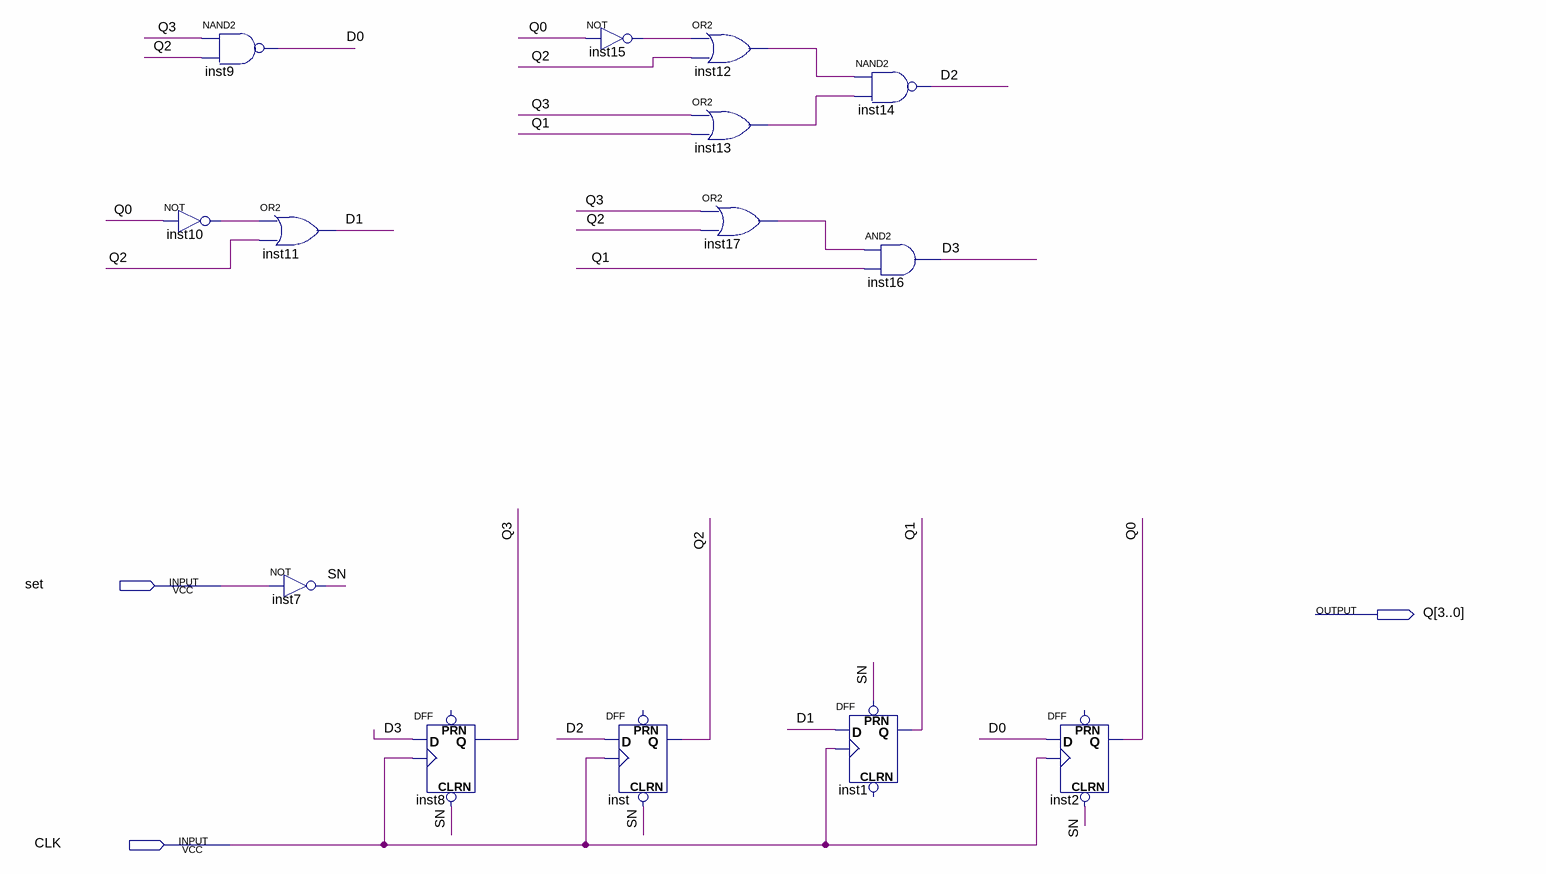
[diagram p0: schematic sheet]
// Quartus schematic contadorprimo.bdf as structural Verilog: 14 symbols, 3 pins
module contadorprimo (
  input  set,
  input  CLK,
  output [3:0] Q
);

  wire D0, D1, D2, D3, inst10_out, inst12_out, inst13_out, inst15_out, inst17_out, SN;

  not inst10 (inst10_out, Q[0]);
  nand inst9 (D0, Q[3], Q[2]);
  or inst11 (D1, inst10_out, Q[2]);
  not inst7 (SN, set);
  DFF inst8 (.CLRN(SN), .CLK(CLK), .D(D3), .Q(Q[3]));  // open: PRN
  not inst15 (inst15_out, Q[0]);
  DFF inst (.CLRN(SN), .CLK(CLK), .D(D2), .Q(Q[2]));  // open: PRN
  or inst12 (inst12_out, inst15_out, Q[2]);
  or inst13 (inst13_out, Q[3], Q[1]);
  or inst17 (inst17_out, Q[3], Q[2]);
  nand inst14 (D2, inst12_out, inst13_out);
  DFF inst1 (.CLK(CLK), .D(D1), .PRN(SN), .Q(Q[1]));  // open: CLRN
  and inst16 (D3, inst17_out, Q[1]);
  DFF inst2 (.CLRN(SN), .CLK(CLK), .D(D0), .Q(Q[0]));  // open: PRN
endmodule
